# EAGLE design lp_pic (EAGLE 7.5.0)
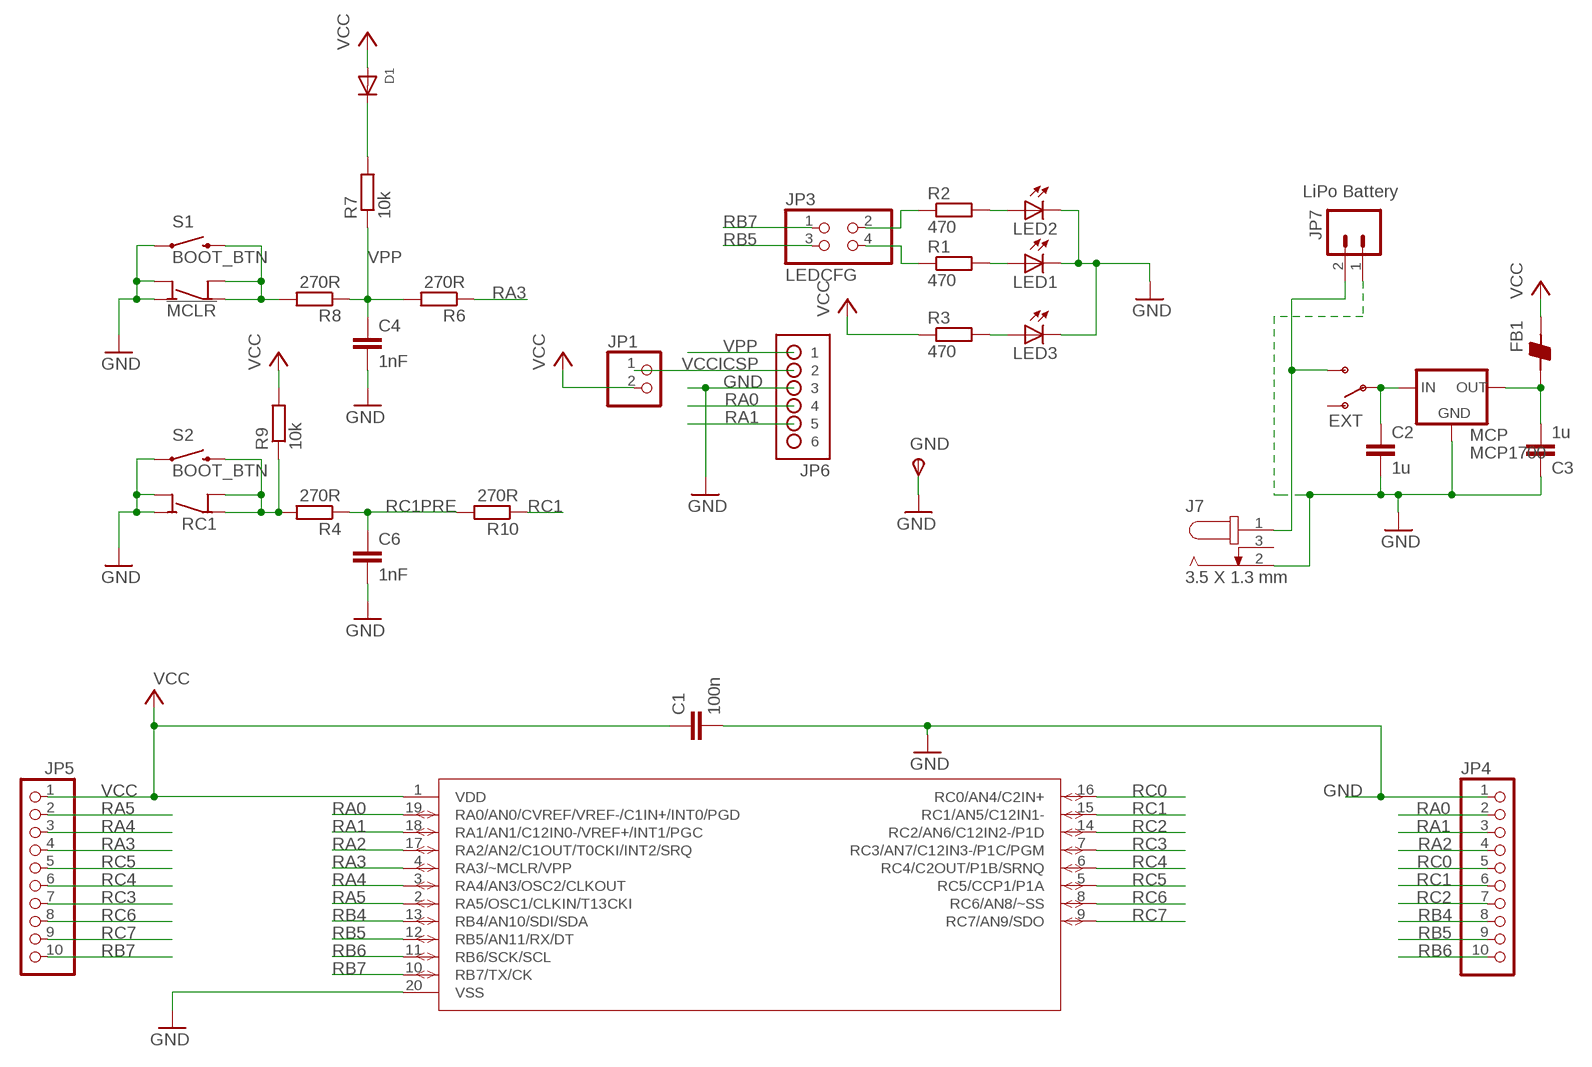
[diagram p0: schematic, sheet 1]

## Parts
!MCLR  !MCLR  SPST4  [6MMTACTILE_4PIN]
C1  100n  C-EUC0805  [C0805]
C2  1u  C-EUC0805  [C0805]
C3  1u  C-EUC0805  [C0805]
C4  1nF  C-EUC0805  [C0805]
C6  1nF  C-EUC0805  [C0805]
D1  DIODESOD-323F  [SOD-323F]
FB1  BEAD-0805  [0805]
GND  TPSTP20R  [TP20R]
J7  3.5 X 1.3 mm  DC_JACK_3.5X1.3MM  [3.5X1.3MM_DC_JACK]
JP1  PINHD-1X2  [1X02]
JP3  LEDCFG  PINHD-2X2  [2X02]
JP4  PH1X10OCT076  [PH1X10OCT76]
JP5  PH1X10OCT076  [PH1X10OCT76]
JP6  No Load  HDR-1X6-OFFSET  [HDR-1X6_OFFSET]
JP7  LiPo Battery  M02JST-PTH-2  [JST-2-PTH]
LED1  0  LEDCHIPLED_1206  [CHIPLED_1206]
LED2  0  LEDCHIPLED_1206  [CHIPLED_1206]
LED3  0  LEDCHIPLED_1206  [CHIPLED_1206]
MCP  MCP1700  MCP1700SOT-23  [SOT-23]
ON  EXT  SWITCH-SPSTPTH  [SWITCH-SPDT]
R1  470  R-EU_R0805  [R0805]
R2  470  R-EU_R0805  [R0805]
R3  470  R-EU_R0805  [R0805]
R4  270R  R-EU_R0805  [R0805]
R6  270R  R-EU_R0805  [R0805]
R7  10k  R-EU_R0805  [R0805]
R8  270R  R-EU_R0805  [R0805]
R9  10k  R-EU_R0805  [R0805]
R10  270R  R-EU_R0805  [R0805]
RC1  RC1  SPST4  [6MMTACTILE_4PIN]
S1  BOOT_BTN  SWITCH-MOMENTARY-2-SMD-1101NE  [TACTILE-SWITCH-1101NE]
S2  BOOT_BTN  SWITCH-MOMENTARY-2-SMD-1101NE  [TACTILE-SWITCH-1101NE]
U$1  PIC18F14K22-I/P  [DIP254P762X533-20]

## Nets
GND [GND]: !MCLR.A1(NO) !MCLR.A2(NO) C1.2 C2.2 C3.1 C4.2 C6.2 GND.TP(PP) J7.2 JP4.1 JP6.3 JP7.1 LED1.C LED2.C LED3.C MCP.1(GND) RC1.A1(NO) RC1.A2(NO) S1.1 S2.1 U$1.20(VSS)
N$1: JP3.2 R2.1
N$2: JP3.4 R1.1
N$3 [VCC]: C2.1 MCP.3(IN) ON.2(P)
N$4: R4.2 R9.1 RC1.B1(COM) RC1.B2(COM) S2.2
N$5: !MCLR.B1(COM) !MCLR.B2(COM) R8.2 S1.2
N$6 [VCC]: C3.2 FB1.1 MCP.2(OUT)
N$7: D1.C R7.2
N$11: LED3.A R3.2
N$13: LED1.A R1.2
N$14: LED2.A R2.2
RA0: JP4.2 JP6.4 U$1.19(RA0/AN0/CVREF/VREF-/C1IN+/INT0/PGD)
RA1: JP4.3 JP6.5 U$1.18(RA1/AN1/C12IN0-/VREF+/INT1/PGC)
RA2: JP4.4 U$1.17(RA2/AN2/C1OUT/T0CKI/INT2/SRQ)
RA3: JP5.4 R6.1 U$1.4(RA3/~MCLR/VPP)
RA4: JP5.3 U$1.3(RA4/AN3/OSC2/CLKOUT)
RA5: JP5.2 U$1.2(RA5/OSC1/CLKIN/T13CKI)
RB4: JP4.8 U$1.13(RB4/AN10/SDI/SDA)
RB5: JP3.3 JP4.9 U$1.12(RB5/AN11/RX/DT)
RB6: JP4.10 U$1.11(RB6/SCK/SCL)
RB7: JP3.1 JP5.10 U$1.10(RB7/TX/CK)
RC0: JP4.5 U$1.16(RC0/AN4/C2IN+)
RC1: JP4.6 R10.1 U$1.15(RC1/AN5/C12IN1-)
RC1PRE: C6.1 R4.1 R10.2
RC2: JP4.7 U$1.14(RC2/AN6/C12IN2-/P1D)
RC3: JP5.7 U$1.7(RC3/AN7/C12IN3-/P1C/PGM)
RC4: JP5.6 U$1.6(RC4/C2OUT/P1B/SRNQ)
RC5: JP5.5 U$1.5(RC5/CCP1/P1A)
RC6: JP5.8 U$1.8(RC6/AN8/~SS)
RC7: JP5.9 U$1.9(RC7/AN9/SDO)
VCC [VCC]: C1.1 D1.A FB1.2 JP1.2 JP5.1 R3.1 R9.2 U$1.1(VDD)
VCCEXT [VCC]: J7.1 JP7.2 ON.3(S)
VCCICSP [VCC]: JP1.1 JP6.2
VPP: C4.1 JP6.1 R6.2 R7.1 R8.1
Unconnected: J7.3 JP6.6 ON.1(O)

## Library data of the parts
!MCLR RC1 = mes_electromech:SPST4: SPST switch with 2 pins per contact
C1-C3 = rcl:C-EU: CAPACITOR, European symbol
C4 C6 = resistor:C-EU: CAPACITOR, European symbol
D1 = adafruit:DIODE: Diode SMADIODE - SMA Surface Mount Package 20V 1A Schottky Diode Digikey: 641-1014-6-ND DO-1N4148 - Through Hole Small Current Diode SOD-123 20V 1 A (.5mV Vf) Schottky Diode - Digikey: MBRX120TPMSCT-ND SOD-323 10V 570mA (.38mV Vf, 3ns) Schottky Diode - Digikey: ZLLS410CT-ND SOD-523 30V 30mA Schottky Diode (RB751S-40TE61) - Digikey: RB751S-40TE61CT-ND SOT23-R/W - SOT23 Package (R = Solder Paste/Reflow Ovens, W = Hand-Soldering) BAT54Film 40V 300mA - Digikey: 497-7162-1-ND
FB1 = CH_passive:BEAD
GND = testpad:TPS: TEST PIN
J7 = MY_CONN:DC_JACK_3.5X1.3MM
JP1 = pinhead:PINHD-1X2: PIN HEADER
JP3 = pinhead:PINHD-2X2: PIN HEADER
JP4 JP5 = MY_CONN:PH1X10
JP6 = Mechanical:HDR-1X6-OFFSET: 42 mil hole pattern with 16mil offset for jtag connector
JP7 = SparkFun:M02: Header 2 Standard 2-pin 0.1" header. Use with straight break away headers (SKU : PRT-00116), right angle break away headers (PRT-00553), swiss pins (PRT-00743), machine pins (PRT-00117), and female headers (PRT-00115). Molex polarized connector foot print use with SKU : PRT-08233 with associated crimp pins and housings.
LED1-LED3 = led:LED: LED OSRAM: - CHIPLED LG R971, LG N971, LY N971, LG Q971, LY Q971, LO R971, LY R971 LH N974, LH R974 LS Q976, LO Q976, LY Q976 LO Q996 - Hyper CHIPLED LW Q18S LB Q993, LB Q99A, LB R99A - SideLED LS A670, LO A670, LY A670, LG A670, LP A670 LB A673, LV A673, LT A673, LW A673 LH A674 LY A675 LS A676, LA A676, LO A676, LY A676, LW A676 LS A679, LY A679, LG A679 - Hyper Micro SIDELED® LS Y876, LA Y876, LO Y876, LY Y876 LT Y87S - SmartLED LW L88C, LW L88S LB L89C, LB L89S, LG L890 LS L89K, LO L89K, LY L89K LS L896, LA L896, LO L896, LY L896 - TOPLED LS T670, LO T670, LY T670, LG T670, LP T670 LSG T670, LSP T670, LSY T670, LOP T670, LYG T670 LG T671, LOG T671, LSG T671 LB T673, LV T673, LT T673, LW T673 LH T674 LS T676, LA T676, LO T676, LY T676, LB T676, LH T676, LSB T676, LW T676 LB T67C, LV T67C, LT T67C, LS T67K, LO T67K, LY T67K, LW E67C LS E67B, LA E67B, LO E67B, LY E67B, LB E67C, LV E67C, LT E67C LW T67C LS T679, LY T679, LG T679 LS T770, LO T770, LY T770, LG T770, LP T770 LB T773, LV T773, LT T773, LW T773 LH T774 LS E675, LA E675, LY E675, LS T675 LS T776, LA T776, LO T776, LY T776, LB T776 LHGB T686 LT T68C, LB T68C - Hyper Mini TOPLED® LB M676 - Mini TOPLED Santana® LG M470 LS M47K, LO M47K, LY M47K Source: http://www.osram.convergy.de LUXEON: - LUMILED® LXK2-PW12-R00, LXK2-PW12-S00, LXK2-PW14-U00, LXK2-PW14-V00 LXK2-PM12-R00, LXK2-PM12-S00, LXK2-PM14-U00 LXK2-PE12-Q00, LXK2-PE12-R00, LXK2-PE12-S00, LXK2-PE14-T00, LXK2-PE14-U00 LXK2-PB12-K00, LXK2-PB12-L00, LXK2-PB12-M00, LXK2-PB14-N00, LXK2-PB14-P00, LXK2-PB14-Q00 LXK2-PR12-L00, LXK2-PR12-M00, LXK2-PR14-Q00, LXK2-PR14-R00 LXK2-PD12-Q00, LXK2-PD12-R00, LXK2-PD12-S00 LXK2-PH12-R00, LXK2-PH12-S00 LXK2-PL12-P00, LXK2-PL12-Q00, LXK2-PL12-R00 Source: www.luxeon.com KINGBRIGHT: KA-3528ASYC Source: www.kingbright.com
MCP = MY_IC:MCP1700
ON = SparkFun:SWITCH-SPST: SPST Switch Simple slide switch. Spark Fun Electronics SKU : COM-00102
R1-R4 R6-R10 = resistor:R-EU_: RESISTOR, European symbol
S1 S2 = SparkFun-Electromechanical:SWITCH-MOMENTARY-2: Various NO switches- pushbuttons, reed, etc
U$1 = thierry_eagle:PIC18F14K22-I/P: Flash Microcontrollers; DESCRIPTION: Flash Microcontrollers; MPN: PIC18F14k22-I/P; OC_FARNELL: 1778462; OC_NEWARK: 07P9675; PACKAGE: PDIP-20; SUPPLIER: Microchip

## Net classes
0 default: width 0.406 mm, drill 0.508 mm
1 GND: width 0.508 mm, drill 0.508 mm
2 VCC: width 1.016 mm, drill 0.508 mm
4 VCCEXT: width 0.762 mm, drill 0.508 mm, clearance 0.229 mm

## Board
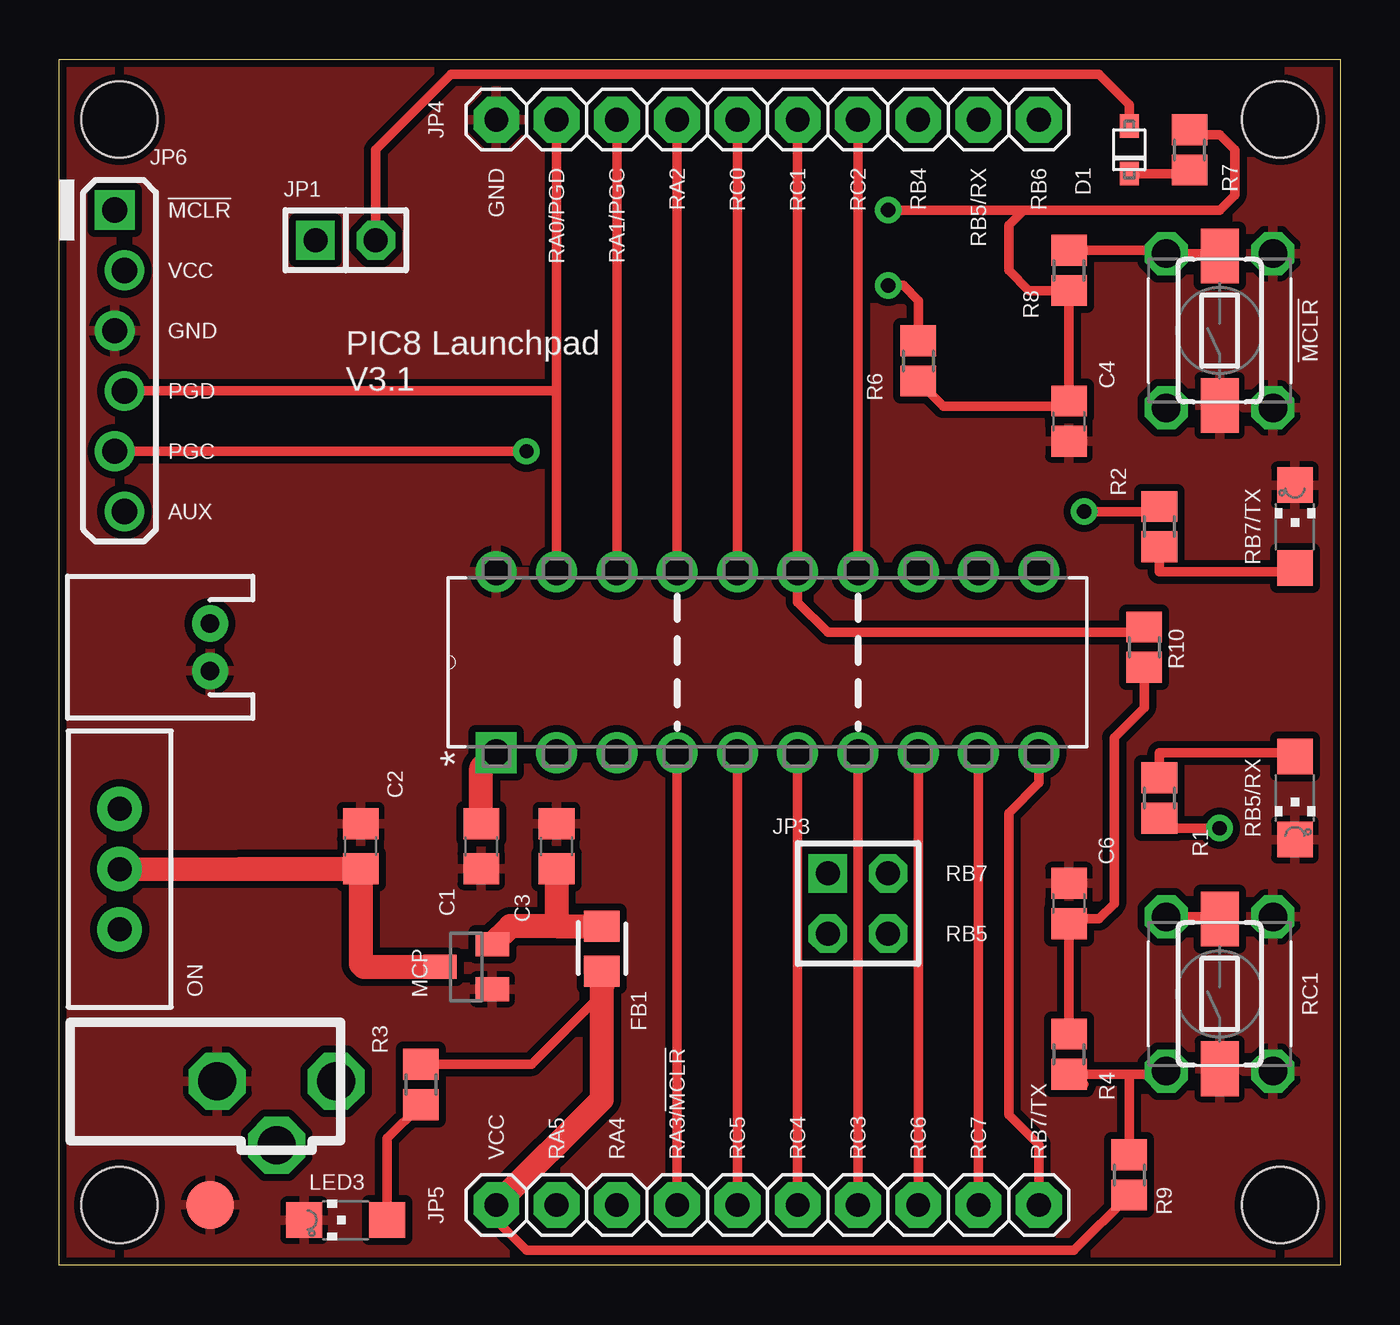
[diagram p1: board, top side]
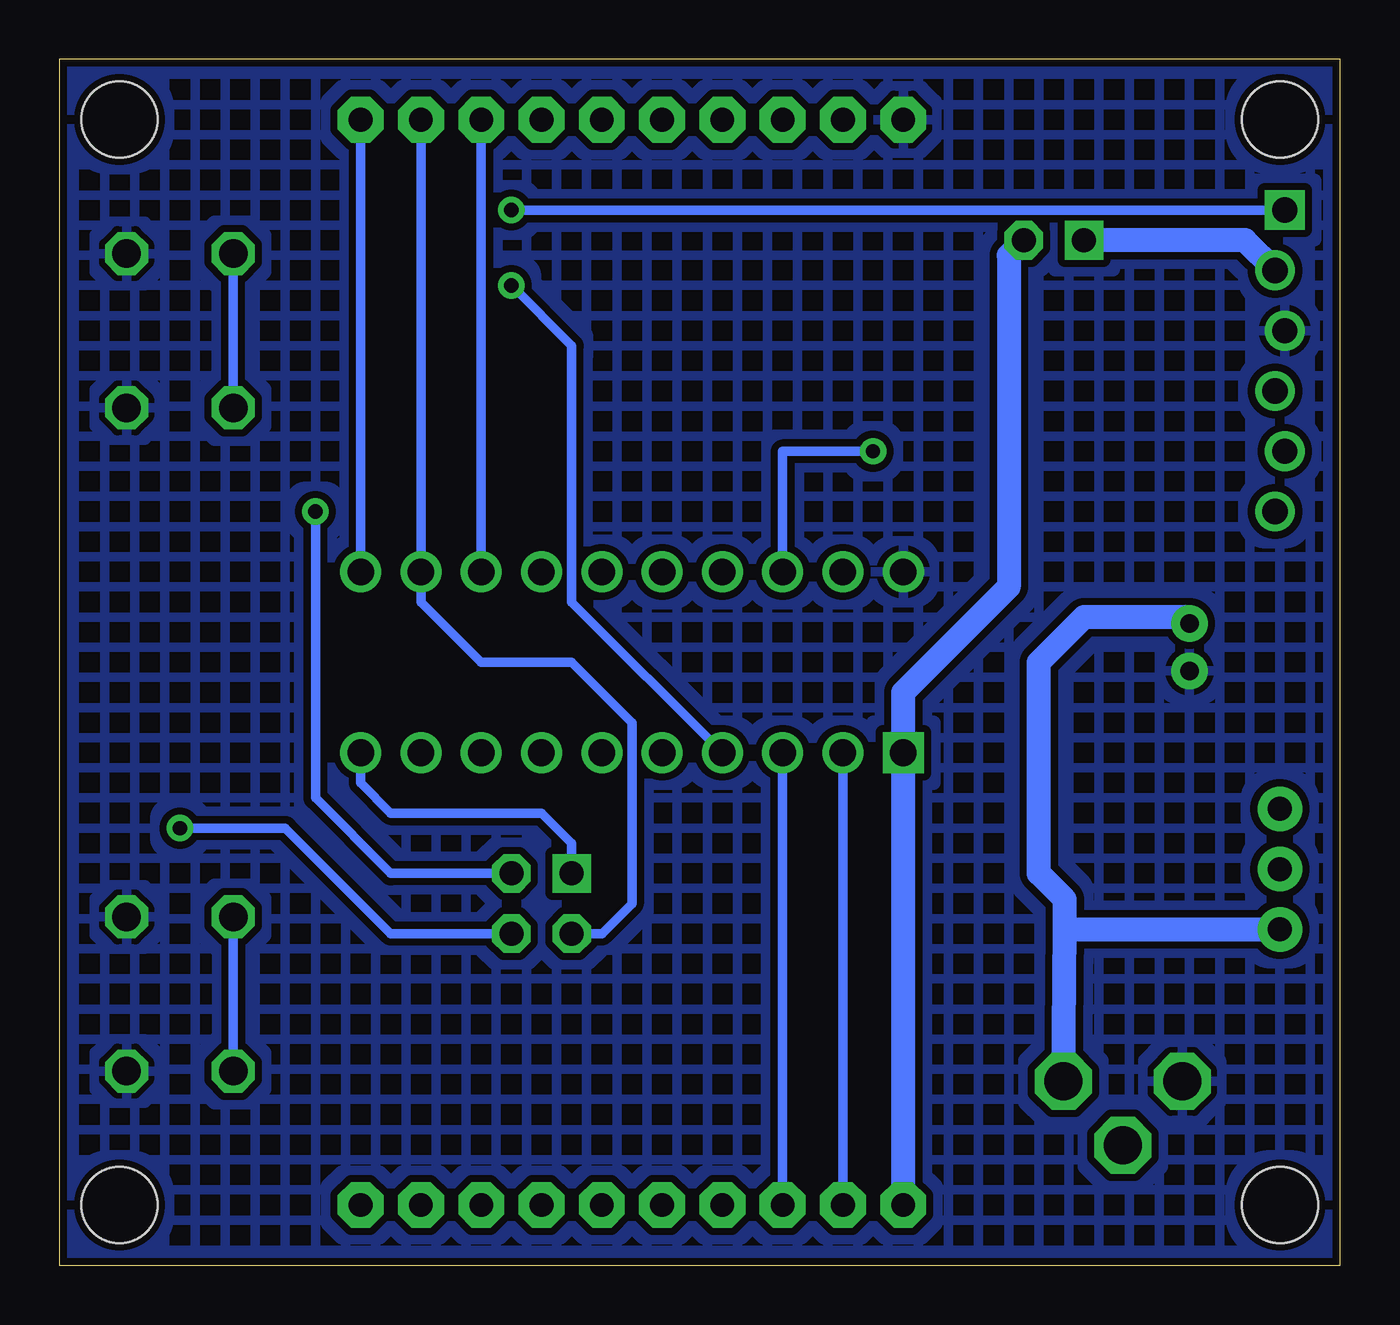
[diagram p2: board, bottom side, seen from below]

Size 53.97 x 50.8 mm. Coordinates in mm from the lower left corner, seen from the top.
Outline: 0,50.8 53.97,50.8 53.97,0 0,0 0,50.8
Copper layers (1*16): Top 0.035mm / dielectric 1.5mm / Bottom 0.035mm
Design rules "SparkFun": minimum track width 8mil, minimum drill 20mil, track to track 8mil, track to pad 8mil, pad to pad 8mil, via to via 8mil, smd to smd 8mil, copper to edge 10mil, drill to drill 8mil, minimum pad ring 12mil, minimum via ring 10mil, stop-mask expansion 4mil, vias tented up to drill 25mil, thermal gap 10mil
Holes 3.2 mm at 2.54,48.26 51.44,48.26 51.44,2.54 2.54,2.54

### Footprints (pad centres in the part's own frame; a part is rotated, then mirrored left to right if it is on the bottom)
6MMTACTILE_4PIN = drill 1.2 octagon: A1 3.25,-2.25; A2 -3.25,-2.25; B1 3.25,2.25; B2 -3.25,2.25
C0805 = smd 1.3 x 1.5: 1 -0.95,0; 2 0.95,0
C0805' = smd 1.3 x 1.5: 1 -0.85,0; 2 0.85,0
SOD-323F = smd 1 x 0.8: A -1,0; C 1,0
0805 = smd 1.3 x 1.5: 1 -0.95,0; 2 0.95,0
TP20R = smd 2 x 2: TP 0,0
3.5X1.3MM_DC_JACK = drill 1.6 octagon: 1 0,0; 2 -5,0; 3 -2.5,-2.7
1X02 = drill 1.016 square: 1 -1.27,0 | drill 1.016 octagon: 2 1.27,0
2X02 = drill 1.016 square: 1 -1.27,-1.27 | drill 1.016 octagon: 2 -1.27,1.27; 3 1.27,-1.27; 4 1.27,1.27
PH1X10OCT76 = drill 1 pad 1.93 octagon: 1 0,0; 2 2.54,0; 3 5.08,0; 4 7.62,0; 5 10.16,0; 6 12.7,0; 7 15.24,0; 8 17.78,0; 9 20.32,0; 10 22.86,0
HDR-1X6_OFFSET = drill 1.067 square: 1 -0.203,6.35 | drill 1.067: 2 0.203,3.81; 3 -0.203,1.27; 4 0.203,-1.27; 5 -0.203,-3.81; 6 0.203,-6.35
JST-2-PTH = drill 0.787 pad 1.524: 1 -1,0; 2 1,0
CHIPLED_1206 = smd 1.5 x 1.5: A 0,-1.75; C 0,1.75
SOT-23 = smd 1 x 1.4: 1 -0.95,-1.1; 2 0.95,-1.1; 3 0,1.1
SWITCH-SPDT = drill 1.016 pad 1.88: 1 0,2.54; 2 0,0; 3 0,-2.54
R0805 = smd 1.3 x 1.5: 1 -0.85,0; 2 0.85,0
TACTILE-SWITCH-1101NE = smd 2.3 x 1.6: 1 -3.15,0; 2 3.15,0
DIP254P762X533-20 = drill 1.118 square: 1 -7.62,22.86 | drill 1.118: 2 -7.62,20.32; 3 -7.62,17.78; 4 -7.62,15.24; 5 -7.62,12.7; 6 -7.62,10.16; 7 -7.62,7.62; 8 -7.62,5.08; 9 -7.62,2.54; 10 -7.62,0; 11 0,0; 12 0,2.54; 13 0,5.08; 14 0,7.62; 15 0,10.16; 16 0,12.7; 17 0,15.24; 18 0,17.78; 19 0,20.32; 20 0,22.86

### Placement (x,y rotation side)
!MCLR  48.89,39.37 90 top
C1  17.78,17.65 270 top
C2  12.7,17.65 90 top
C3  20.96,17.65 270 top
C4  1nF  [C0805']  42.55,35.56 270 top
C6  1nF  [C0805']  42.55,15.24 90 top
D1  45.08,46.99 270 top
FB1  22.86,13.34 270 top
GND  6.35,2.54 0 top
J7  11.66,7.75 0 top
JP1  12.07,43.18 0 top
JP3  33.66,15.24 270 top
JP4  18.42,48.26 0 top
JP5  18.42,2.54 0 top
JP6  2.54,38.1 0 top
JP7  6.35,26.04 90 top
LED1  52.07,19.68 180 top
LED2  52.07,31.11 0 top
LED3  12.07,1.91 90 top
MCP  17.14,12.57 90 top
ON  2.54,16.69 0 top
R1  46.35,19.68 90 top
R2  46.35,31.11 270 top
R3  15.24,7.62 270 top
R4  42.55,8.89 270 top
R6  36.19,38.1 270 top
R7  47.62,46.99 270 top
R8  42.55,41.91 90 top
R9  45.08,3.81 270 top
R10  45.72,26.04 270 top
RC1  48.89,11.43 90 top
S1  48.89,39.37 90 top
S2  48.89,11.43 90 top
U$1  41.28,29.21 90 top

### Tracks (layer width: path | path; a pad name or v marks a point on that pad's centre or on a via)
GND
  pour Top (isolate 0.305): -0.25,-0.51 54.99,-0.51 54.99,51.31 -0.25,51.31
  pour Bottom (isolate 0.305, hatched): -0.25,-0.51 54.99,-0.51 54.99,51.31 -0.25,51.31
N$1  (via drill 0.6)
  Top 0.406: v43.18,31.75 46.14,31.75 R2.1
  Bottom 0.406: JP3.2 40,16.51 43.18,19.68 v43.18,31.75
N$2  (via drill 0.6)
  Top 0.406: v48.89,18.41 46.77,18.41 R1.1
  Bottom 0.406: JP3.4 40,13.97 44.45,18.41 v48.89,18.41
N$3
  Top 1.016: ON.2 7.64,16.7 C2.1 12.7,12.7 12.83,12.57 MCP.3
N$4
  Top 0.406: 43.18,7.62 R4.2 45.08,8.04 | RC1.B2 46.5,8.04 45.08,8.04 | R9.1 45.08,8.04 | S2.2 48.8,14.68 RC1.B1
  Bottom 0.406: RC1.B1 RC1.B2
N$5
  Top 0.406: 42.55,42.62 R8.2 46.5,42.76 !MCLR.B1 48.8,42.62 S1.2
  Bottom 0.406: !MCLR.B2 !MCLR.B1
N$6
  Top 1.016: 20.96,14.29 FB1.1 | C3.2 20.96,14.29 | 20.96,14.29 19.01,14.29 MCP.2
N$7
  Top 0.406: D1.C 47.47,45.99 R7.2
N$11
  Top 0.406: LED3.A 13.82,5.35 R3.2
N$13
  Top 0.406: R1.2 46.35,21.59 52.07,21.59 LED1.A
N$14
  Top 0.406: R2.2 46.35,29.21 52.07,29.21 LED2.A
RA0
  Top 0.406: JP6.4 20.96,36.83 | JP4.2 20.96,36.83 | 20.96,36.83 U$1.19
RA1  (via drill 0.6)
  Top 0.406: JP6.5 v19.68,34.29 | JP4.3 U$1.18
  Bottom 0.406: v19.68,34.29 23.5,34.29 U$1.18
RA2
  Top 0.406: JP4.4 U$1.17
RA3  (via drill 0.6)
  Top 0.406: U$1.4 JP5.4 | v34.92,41.27 35.56,41.27 36.19,40.64 R6.1
  Bottom 0.406: U$1.4 32.39,27.94 32.39,38.73 v34.92,41.27
RA4
  Bottom 0.406: JP5.3 U$1.3
RA5
  Bottom 0.406: U$1.2 JP5.2
RB4
  Bottom 0.406: JP4.8 U$1.13
RB5
  Bottom 0.406: JP4.9 U$1.12 38.73,27.94 36.19,25.4 32.39,25.4 29.85,22.86 29.85,15.24 31.11,13.97 JP3.3
RB6
  Bottom 0.406: JP4.10 U$1.11
RB7
  Top 0.406: JP5.10 41.28,5.08 40,6.35 40,19.05 41.28,20.32 U$1.10
  Bottom 0.406: U$1.10 41.28,20.32 40,19.05 33.66,19.05 32.39,17.78 JP3.1
RC0
  Top 0.406: JP4.5 U$1.16
RC1
  Top 0.406: JP4.6 U$1.15 31.11,27.94 32.39,26.67 45.5,26.67 R10.1
RC1PRE
  Top 0.406: R4.1 C6.1 42.76,14.61 43.81,14.61 44.45,15.24 44.45,22.22 45.72,23.49 R10.2
RC2
  Top 0.406: JP4.7 U$1.14
RC3
  Top 0.406: U$1.7 JP5.7
RC4
  Top 0.406: U$1.6 JP5.6
RC5
  Top 0.406: U$1.5 JP5.5
RC6
  Top 0.406: JP5.8 U$1.8
RC7
  Top 0.406: JP5.9 U$1.9
VCC
  Top 0.406: R9.2 42.76,0.64 19.68,0.64 18.42,1.91 JP5.1 | R3.1 19.9,8.47 22.86,11.43 | D1.A 45.08,48.9 43.81,50.16 16.51,50.16 13.33,46.99 JP1.2
  Top 1.016: 22.86,11.64 FB1.2 22.86,11.43 22.86,6.99 JP5.1 | C1.1 17.78,20.95 U$1.1
  Bottom 1.016: JP5.1 U$1.1 18.42,24.13 13.97,28.57 13.97,42.55 JP1.2
VCCEXT
  Bottom 1.016: J7.1 11.61,14.15 | 11.61,14.15 ON.3 | JP7.2 6.35,27.3 10.79,27.3 12.7,25.4 12.7,16.51 11.61,15.42 11.61,14.15
VCCICSP
  Bottom 1.016: JP6.2 4.01,43.18 JP1.1
VPP  (via drill 0.6)
  Top 0.406: 36.19,36.83 R6.2 37.25,36.2 42.33,36.2 C4.1 R8.1 40.86,41.06 40,41.91 40,43.82 40.64,44.45 | R7.1 47.84,47.62 48.89,47.62 49.53,46.99 49.53,45.09 48.89,44.45 40.64,44.45 | v34.92,44.45 40.64,44.45
  Bottom 0.406: v34.92,44.45 JP6.1

### Text on the board
tPlace: PIC8 Launchpad / V3.1 | RB7/TX | RB5/RX | RB7 | RB5
tNames: GND | RA0/PGD | RA1/PGC | RA2 | RC0 | RC1 | RC2 | RB4 | RB5/RX | RB6 | !MCLR | VCC | GND | PGD | PGC | AUX | ON | VCC | RA5 | RA4 | RA3/!MCLR | RC5 | RC4 | RC3 | RC6 | RC7 | RB7/TX